# Altium schematic sheet Audio_Output.SchDoc
size A3; Author: Samuel Pittton&co; Organization: ETML-ES; Address1: Avenue Recordon 1; Address2: 1004 Lausanne; Address3: Switzerland; SheetNumber: 5; SheetTotal: 6
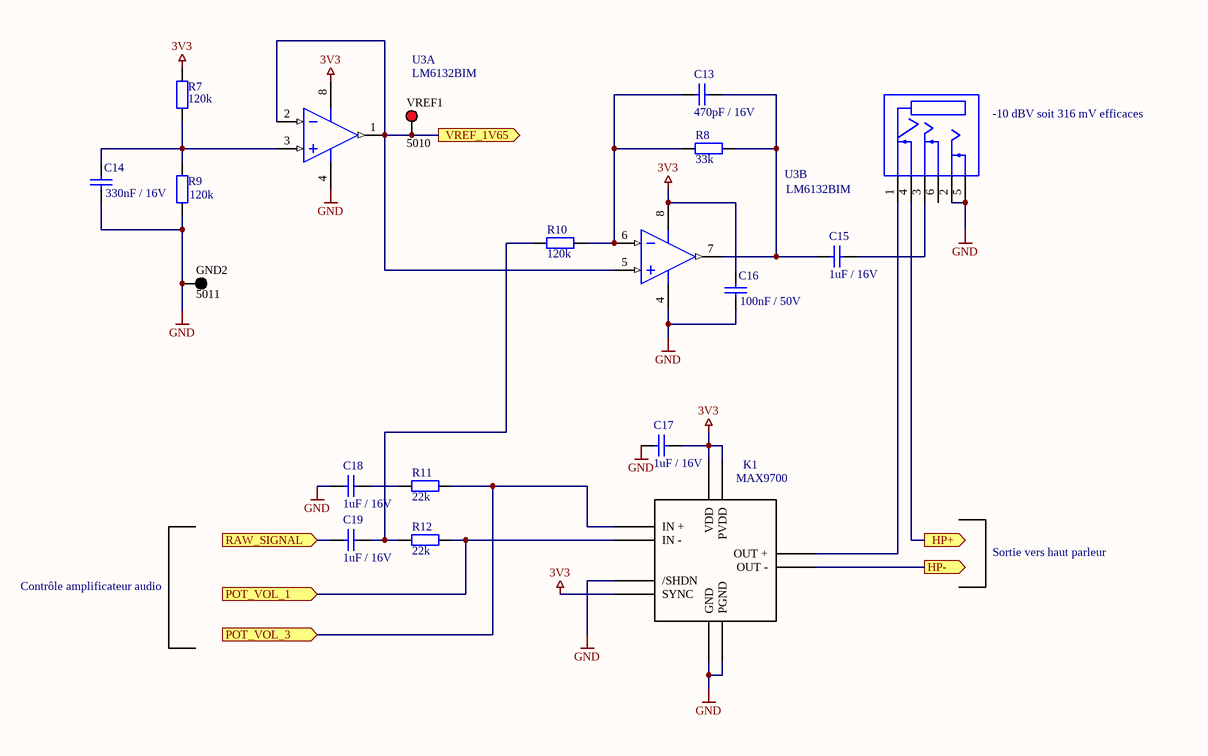
[diagram p0: Audio_Output.SchDoc]

## Parts
C13  470pF / 16V  [CAPC0805]
C14  330nF / 16V  [CAPC0805]
C15  1uF / 16V  [CAPC0805]
C16  100nF / 50V  [CAPC0805]
C17  1uF / 16V  [CAPC0805]
C18  1uF / 16V  [CAPC0805]
C19  1uF / 16V  [CAPC0805]
GND2  5011  [KSTN-5011_V]
J4  SJ-63073E  [CUI_SJ-63073E]  (value not drawn)
K1  MAX9700  [SOP50P490X110-10N]
R7  120k  [RESC0805]
R8  33k  [RESC0805]
R9  120k  [RESC0805]
R10  120k  [RESC0805]
R11  22k  [RESC0805]
R12  22k  [RESC0805]
U3  LM6132BIM  [D0008A_N]  (parts A,B of 2)
VREF1  5010  [KSTN-5010_V]

## Ports
HP+ (out), HP- (out), POT_VOL_1 (in), POT_VOL_3 (in), RAW_SIGNAL (in), VREF_1V65 (out)

## Nets
3V3: C16.2 C17.2 K1.1(VDD) K1.6(SYNC) K1.10(PVDD) R7.2 U3.8(V+)
GND: C14.1 C16.1 C17.1 C18.1 GND2.1 J4.2(TIP) J4.5(TIP_SWITCH) K1.4(GND) K1.5(/SHDN) K1.7(PGND) R9.1 U3.4(V-)
HP+: J4.4(SLEEVE_SWITCH) ; port HP+
HP-: K1.9(OUT_-) ; port HP-
POT_VOL_1: K1.3(IN_-) R12.1 ; port POT_VOL_1
POT_VOL_3: K1.2(IN_+) R11.1 ; port POT_VOL_3
RAW_SIGNAL: C19.2 ; port RAW_SIGNAL
VREF_1V65: U3.1(OUTA) U3.2(INA-) U3.5(INB+) VREF1.1 ; port VREF_1V65
NetC13_1: C13.1 C15.2 R8.1 U3.7(OUTB)
NetC13_2: C13.2 R8.2 R10.1 U3.6(INB-)
NetC14_2: C14.2 R7.1 R9.2 U3.3(INA+)
NetC15_1: C15.1 J4.3(RING)
NetC18_2: C18.2 R11.2
NetC19_1: C19.1 R10.2 R12.2
NetJ4_1: J4.1(SLEEVE) K1.8(OUT_+)

Not connected (* = marked no-connect by the designer): J4 6(RING_SWITCH)

## Notes on the sheet
- -10 dBV soit 316 mV efficaces
- Contrôle amplificateur audio
- Sortie vers haut parleur
- Fichier :
- a
- Date :
- Heure :
- Version :
- Auteur :
- Modif.
- b
- c
- d
- Projet :
- No :
- Nb feuilles
- Feuille n°
- Chemin :

## Library data of the parts
C13-C19 = Cap: Capacitor; Published: 8-Jun-2000; LatestRevisionDate: 17-Jul-2002; LatestRevisionNote: Re-released for DXP Platform.; PackageReference: RAD-0.3; Publisher: Altium Limited; PackageDescription: Radial Cap, Thru-Hole; 2 Leads; 0.3 in Pin Spacing
GND2 = CMP-1672-00003-4: Test Point, Black, Through Hole, RoHS, Bulk; Manufacturer: Keystone; ComponentLink2URL: http://www.keyelco.com/product-pdf.cfm?p=1320; Colour: Black; Pins: 1; REACH SVHC: No SVHC; ComponentLink1URL: http://www.keyelco.com/; PackageReference: 5011; Contact Plating: Silver; Package Quantity: 100; Packaging: Bulk; RoHSCompliant: true; Height: 8.12 mm; PackageDescription: 1-Pin Through Hole Device, Dia 3.17 mm; Mount: Through Hole; Mounting Technology: Through Hole; DatasheetVersion: Rev. F, 12/2013; ComponentLink1Description: Manufacturer URL; Contact Material: Bronze; ComponentLink2Description: Datasheet
J4 = SJ-63073E: Audio/RCA Connector; MF: CUI Devices; Availability: Warning; Value: SJ-63073E; CUI_purchase_URL: https://www.cuidevices.com/product/interconnect/connectors/audio-connectors/jacks/sj-6307-series?utm_source=snapeda.com&utm_medium=referral&utm_campaign=snapedaBOM; Package: Package; Price: None; MP: SJ-63073E; SnapEDA_Link: https://www.snapeda.com/parts/SJ-63073E/CUI%20Devices/view-part/4973947/?ref=snap; Mouser-Purchase-URL: https://snapeda.com/shop?store=Mouser&id=4973947; BuyPart: https://www.snapeda.com/parts/SJ-63073E/CUI%20Devices/view-part/4973947/?ref=eda; Manufacturer 1: CUI Devices; Manufacturer Part Number 1: SJ-63073E; RoHS: No; Category: Audio / Video Connectors; Stock 1: 1172; Pricing 1: 1=1,85000, 10=1,60700, 25=1,53920, 50=1,50480, 100=1,43640, 250=1,29960, 500=1,19700, 1000=1,02600, 2500=0,95760 (USD); Supplier 1: Digi-Key; Supplier Part Number 1: 2223-SJ-63073E-ND
K1 = MAX9700: Puissance: 1.2W; Supplier 1: Mouser; Supplier Part Number 1: 700-MAX9700AEUB
R7-R12 = RES: Resistor
U3 = CMP-0055-00790-3: Dual Low Power 10 MHz Rail-to-Rail I/O Operational Amplifier, 8-pin Narrow SOIC; Manufacturer: Texas Instruments; CompType: Amplifiers; PowerWise: N; PackageTopMarking: NSZXTT*LM61*32BIM; Package Reference: D0008A; Code_IPC: SOIC127P600-8; PinCount: 8; ComponentLink1Description: Datasheet URL; PackageDescription: SOIC Narrow, 4.9 x 3.9 x 1.45mm, 8 Lead, 1.27mm Pitch; RoHS: N; ComponentLink1URL: http://www.ti.com/general/docs/lit/getliterature.tsp?genericPartNumber=LM6132&fileType=pdf; Code_JEDEC: MS-012-AA
VREF1 = CMP-1672-00002-4: Test Point, Red, Through Hole, RoHS, Bulk; Manufacturer: Keystone; Contact Material: Bronze; Mounting Technology: Through Hole; RoHSCompliant: true; Pins: 1; Package Quantity: 100; ComponentLink2Description: Datasheet; Height: 8.12 mm; ComponentLink1URL: http://www.keyelco.com/; DatasheetVersion: Rev. F, 12/2013; Mount: Through Hole; PackageReference: 5010; Contact Plating: Silver; Packaging: Bulk; Colour: Red; REACH SVHC: No SVHC; PackageDescription: 1-Pin Through Hole Device, Dia 3.17 mm; ComponentLink2URL: http://www.keyelco.com/product-pdf.cfm?p=1319; ComponentLink1Description: Manufacturer URL